# EAGLE design MWInjector (EAGLE 8.6.0)
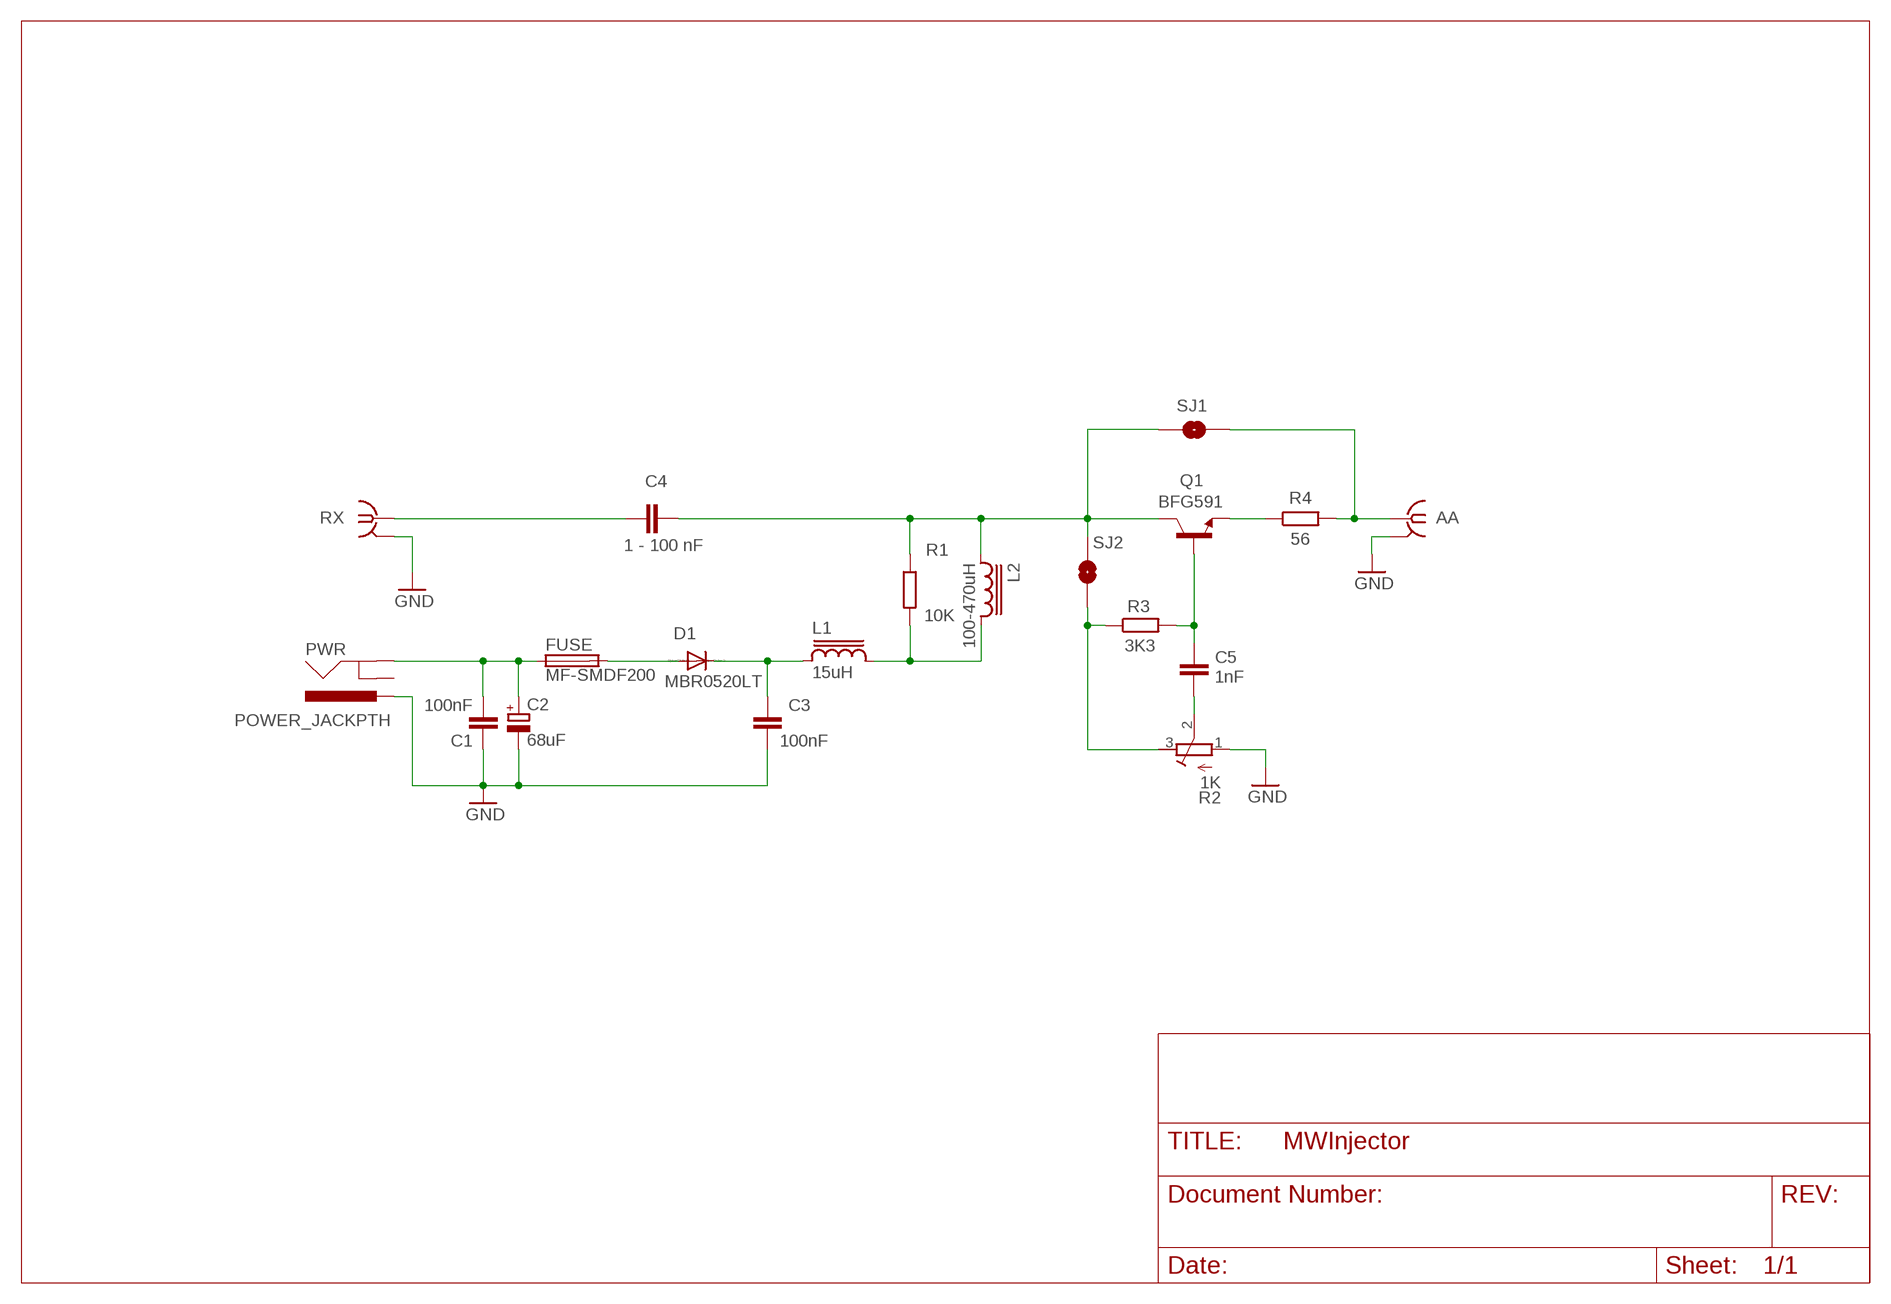
[diagram p0: schematic, sheet 1]

## Parts
AA  SMA-142-0701-851/861  [J502-ND-142-0701-851/861]
C1  100nF  C-EUC1206  [C1206]
C2  68uF  CPOL-EUSMCC  [SMC_C]
C3  100nF  C-EUC1206  [C1206]
C4  1 - 100 nF  C-EUC1206  [C1206]
C5  1nF  C-EUC1206  [C1206]
D1  MBR0520LT  [SOD123]
FUSE  MF-SMDF200  [MF-SMDF050]
L1  15uH  CDRH6D38  [CDRH6D]
L2  100-470uH  CDRH104R  [CDRH104R]
PWR  POWER_JACKPTH  [POWER_JACK_PTH]
Q1  BFG591  [SOT223]
R1  10K  R-EU_R1206  [R1206]
R2  1K  R-TRIMM3202  [RTRIM3202]
R3  3K3  R-EU_R1206  [R1206]
R4  56  R-EU_R2512  [R2512]
RX  SMA-142-0701-851/861  [J502-ND-142-0701-851/861]
SJ1  SOLDERJUMPERNO  [SJ_2S-NO]
SJ2  SOLDERJUMPERNO  [SJ_2S-NO]

## Nets
+12V: C1.2 C2.+ FUSE.1 PWR.GND
GND: AA.G@1 AA.G@2 AA.G@3 AA.G@4 C1.1 C2.- C3.1 PWR.PWR R2.1(A) RX.G@1 RX.G@2 RX.G@3 RX.G@4
N$1: R2.3(E) R3.1 SJ2.1
N$3: D1.A FUSE.2
N$4: C4.2 RX.1
N$5: C4.1 L2.1 Q1.4(C) R1.1 SJ1.1 SJ2.2
N$6: L1.2 L2.2 R1.2
N$7: C3.2 D1.C L1.1
N$8: Q1.1(E) Q1.3(E) R4.1
N$9: C5.2 Q1.2(B) R3.2
N$10: C5.1 R2.2(S)
N$11: AA.1 R4.2 SJ1.2
Unconnected: PWR.GNDBREAK

## Library data of the parts
AA RX = con-coax:SMA-: SMA 50 Ohm End Launch Jack Receptacle - Round Contact Johnson Components Source: www.johnsoncomponents.com .. J502-ND.pdf; MF: JOHNSON COMPONENTS; MPN: 142-0701-851; OC_FARNELL: 1019325; OC_NEWARK: 99F6798
C1 C3-C5 = resistor:C-EU: CAPACITOR, European symbol
C2 = resistor:CPOL-EU: POLARIZED CAPACITOR, European symbol
D1 = diode:MBR0520LT: SCHOTTKY BARRIER RECTIFIER Source: http://onsemi.com .. MBR0520LT1-D.pdf
FUSE = fuse:MF-SMDF: MF-SMDF Series - PRC Resettable Fuses Source: http://www.farnell.com/datasheets/716597.pdf
L1 = inductor-sumida:CDRH6D38: Power Inductor
L2 = inductor-sumida:CDRH104R: Power Inductor
PWR = SparkFun-Connectors:POWER_JACK: Power Jack This is the standard 5.5mm barrel jack for power. The PTH is the most common, proven, reliable, footprint. The Slot footprint only works if the mill layer is transmitted to the PCB fab house so be warned. Spark Fun Electronics SKU : PRT-00119 SMT: CONN-08106 Mating wall wart : TOL-00298 (and others)
Q1 = transistor-npn-my:BFG591: NPN Transistor
R1 R3 R4 = resistor:R-EU_: RESISTOR, European symbol
R2 = resistor:R-TRIMM: Trimm resistor
SJ1 SJ2 = SparkFun-Passives:SOLDERJUMPER: Solder Jumper Standard SMD solder jumper. Used to automate production. Two varients : Normally Open and Normally Closed are the same, but have different paste layers. NC will have a large amount of paste and should jumper during reflow.

## Board
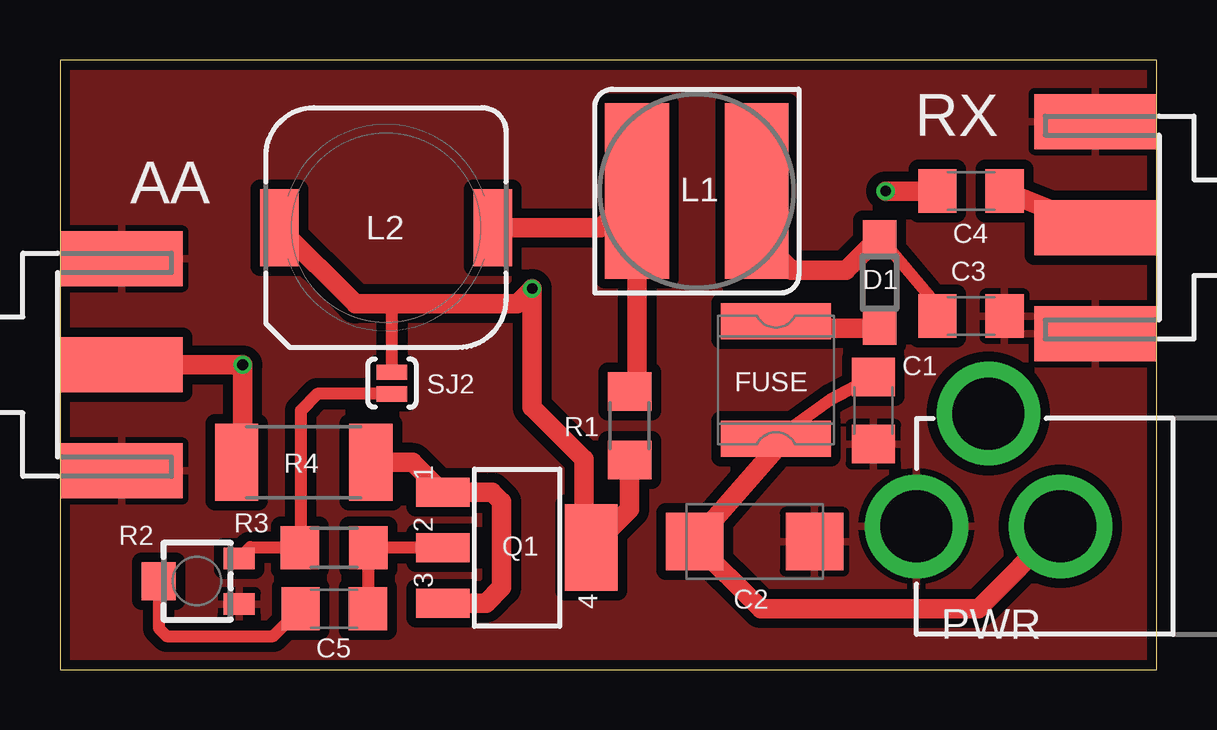
[diagram p1: board, top side]
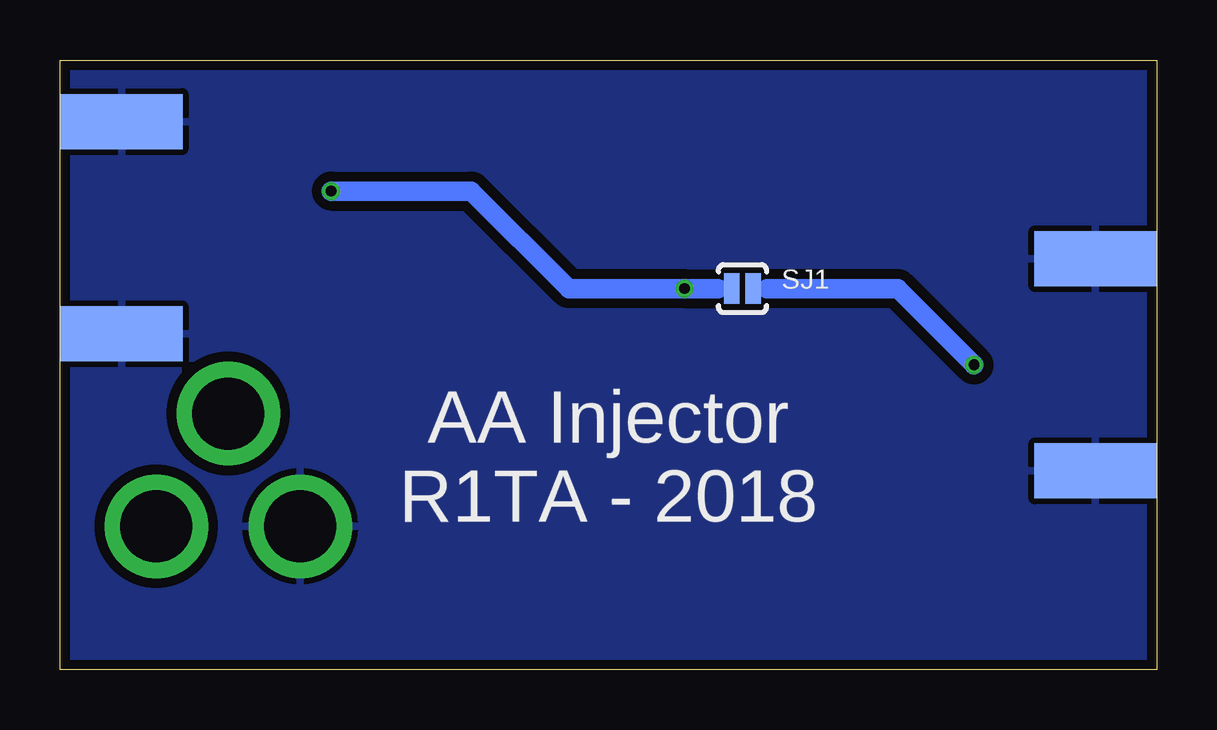
[diagram p2: board, bottom side, seen from below]

Size 45.72 x 25.4 mm. Coordinates in mm from the lower left corner, seen from the top.
Outline: 0,0 45.72,0 45.72,25.4 0,25.4 0,0
Copper layers (1*16): Top 0.035mm / dielectric 1.5mm / Bottom 0.035mm
Design rules "SeeedStudio_2layer_DRU_no_angle_20140221": minimum track width 6mil, minimum drill 12mil, track to track 6mil, track to pad 6mil, pad to pad 6mil, via to via 6mil, smd to smd 0mil, copper to edge 10mil, drill to drill 10mil, minimum pad ring 10mil, minimum via ring 6mil, stop-mask expansion 2mil, vias tented up to drill 100mil, thermal gap 10mil

### Footprints (pad centres in the part's own frame; a part is rotated, then mirrored left to right if it is on the bottom)
J502-ND-142-0701-851/861 = smd 5.08 x 2.286: 1 2.565,0; G@1 2.565,4.42; G@2 2.565,-4.42 | smd 5.08 x 2.286 bottom: G@3 2.565,4.42; G@4 2.565,-4.42
C1206 = smd 1.6 x 1.8: 1 -1.4,0; 2 1.4,0
SMC_C = smd 2.4 x 2.4: + -2.5,0; - 2.5,0
SOD123 = smd 1.4 x 1.4: A 1.9,0; C -1.9,0
MF-SMDF050 = smd 1.5 x 4.6: 1 -2.45,0; 2 2.45,0
CDRH6D = smd 7.3 x 2.65: 1 0,2.493; 2 0,-2.493
CDRH104R = smd 3.2 x 1.6: 1 0,4.45; 2 0,-4.45
POWER_JACK_PTH = drill 2.997 pad 4.318: GND 0,7.7; GNDBREAK 4.7,10.7; PWR 0,13.7
SOT223 = smd 1.219 x 2.235: 1 -2.311,-3.099; 2 0,-3.099; 3 2.311,-3.099 | smd 3.6 x 2.2: 4 0,3.099
R1206 = smd 1.6 x 1.803: 1 -1.422,0; 2 1.422,0
RTRIM3202 = smd 0.9 x 1.3: 1 -0.95,-1.75; 3 0.95,-1.75 | smd 1.6 x 1.4: 2 0,1.6
R2512 = smd 1.8 x 3.2: 1 -2.8,0; 2 2.8,0
SJ_2S-NO = smd 0.635 x 1.27: 1 -0.45,0; 2 0.45,0

### Placement (x,y rotation side)
AA  0,12.7 0 top
C1  33.91,10.79 90 top
C2  28.96,5.33 0 top
C3  37.97,14.73 180 top
C4  37.97,19.94 0 top
C5  11.43,2.54 0 top
D1  34.16,16.13 270 top
FUSE  29.84,12.06 90 top
L1  26.54,19.94 270 top
L2  13.59,18.41 90 top
PWR  49.4,5.97 90 top
Q1  19.05,5.08 270 top
R1  23.75,10.16 90 top
R2  5.71,3.68 90 top
R3  11.43,5.08 0 top
R4  10.16,8.64 180 top
RX  45.72,18.41 180 top
SJ1  17.27,15.88 0 bottom
SJ2  13.84,11.94 90 top

### Tracks (layer width: path | path; a pad name or v marks a point on that pad's centre or on a via)
+12V
  Top 0.508: FUSE.1 32.13,11.26 C1.2
  Top 0.813: PWR.GND 38.27,2.54 29.21,2.54 26.46,5.29 C2.+ 29.97,9.36 FUSE.1
GND
  pour Top (isolate 0.406): 0,0 0,25.4 45.72,25.4 45.72,0
  pour Bottom (isolate 0.406): 0,0 0,25.4 45.72,25.4 45.72,0
N$1
  Top 0.508: 10.03,5.11 R3.1 | R2.3 7.94,5.11 10.03,5.11 | SJ2.1 10.73,11.49 10.03,10.79 10.03,5.11
N$3
  Top 0.813: FUSE.2 31.27,14.23 D1.A
N$4
  Top 0.813: RX.1 C4.2
N$5  (via drill 0.45)
  Top 0.508: SJ2.2 13.84,12.7 13.84,12.96 13.84,15.24
  Top 0.813: C4.1 v34.42,19.94 | R1.1 23.75,6.68 Q1.4 21.84,5.38 21.84,8.76 19.68,10.92 v19.68,15.88 19.05,15.24 13.84,15.24 12.31,15.24 L2.1
  Bottom 0.508: 18.29,15.88 SJ1.1
  Bottom 0.813: v34.42,19.94 28.57,19.94 24.51,15.88 v19.68,15.88 18.29,15.88
N$6
  Top 0.813: R1.2 24.05,11.88 L1.2 22.53,18.41 L2.2
N$7
  Top 0.508: D1.C 36.95,14.73 C3.2
  Top 0.813: D1.C 32.77,16.64 30.48,16.64 29.04,18.08 L1.1
N$8
  Top 0.813: R4.1 14.71,8.64 Q1.1 18.01,7.39 18.41,6.99 18.41,3.43 17.75,2.77 Q1.3
N$9
  Top 0.508: Q1.2 R3.2 12.85,2.56 C5.2
N$10
  Top 0.508: R2.2 4.12,1.73 4.45,1.4 8.89,1.4 C5.1
N$11  (via drill 0.45)
  Top 0.813: AA.1 v7.62,12.7 7.62,8.9 R4.2
  Bottom 0.508: 16.26,15.88 SJ1.2
  Bottom 0.813: v7.62,12.7 10.79,15.88 16.26,15.88

### Text on the board
bNames: AA Injector / R1TA - 2018